# EAGLE schematic untitled (EAGLE 9.6.2)
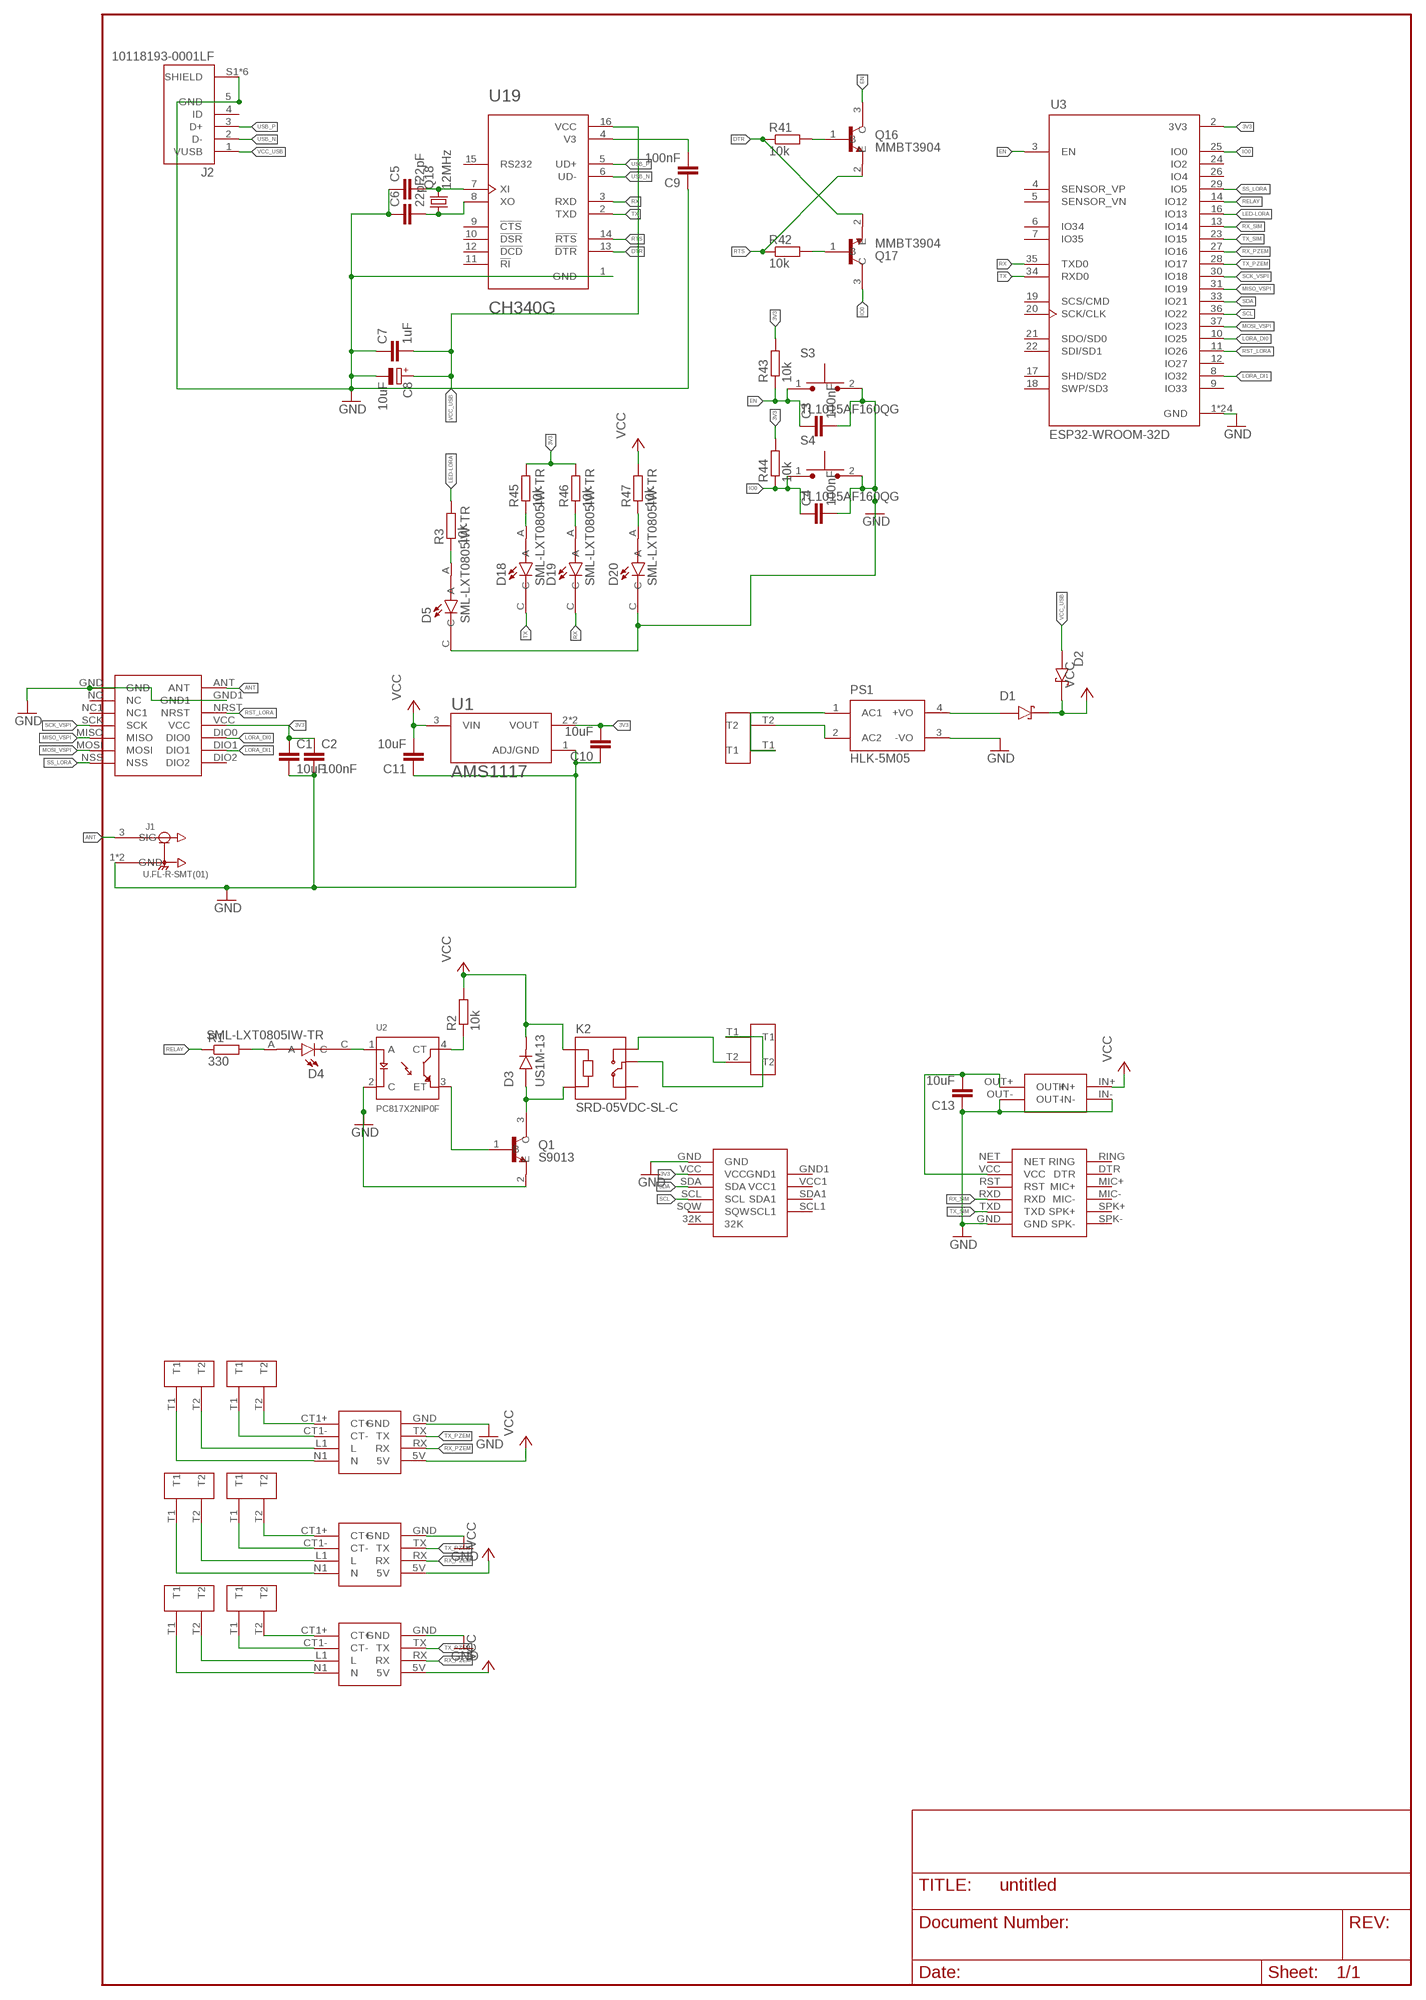
[diagram p0: schematic, sheet 1]

## Parts
C1  10uF  C-EUC0805K  [C0805K]
C2  100nF  C-EUC0805K  [C0805K]
C3  100nF  C-EUC0805K  [C0805K]
C4  100nF  C-EUC0805K  [C0805K]
C5  22pF  C-EUC0805K  [C0805K]
C6  22pF  C-EUC0805K  [C0805K]
C7  1uF  C-EUC0805K  [C0805K]
C8  10uF  CPOL-EU153CLV-0505  [153CLV-0505]
C9  100nF  C-EUC0805K  [C0805K]
C10  10uF  C-EUC0805K  [C0805K]
C11  10uF  C-EUC0805K  [C0805K]
C13  10uF  C-EUC0805K  [C0805K]
D1  1N5819HW-7  [SOD3715X145N]
D2  1N5819HW-7  [SOD3715X145N]
D3  US1M-13  [DIOM5226X240N]
D4  SML-LXT0805IW-TR  [LEDC2012X120N]
D5  SML-LXT0805IW-TR  [LEDC2012X120N]
D18  SML-LXT0805IW-TR  [LEDC2012X120N]
D19  SML-LXT0805IW-TR  [LEDC2012X120N]
D20  SML-LXT0805IW-TR  [LEDC2012X120N]
J1  U.FL-R-SMT(01)  [HRS_U.FL-R-SMT(01)]
J2  10118193-0001LF  [FCI_10118193-0001LF]
K2  SRD-05VDC-SL-C  [RELAY_SRD-05VDC-SL-C]
LORA-NICERF-V1  LORA-NICERF-V2  [LORA-NICERF-V2]
MINI1  MINI360  [MINI360]
PS1  HLK-5M05  [CONV_HLK-5M05]
PZEM004T1  PZEM004T  [PZEM004T]
PZEM004T2  PZEM004T  [PZEM004T]
PZEM004T3  PZEM004T  [PZEM004T]
Q1  S9013  [SOT95P240X120-3N]
Q16  MMBT3904  [SOT95P240X120-3N]
Q17  MMBT3904  [SOT95P240X120-3N]
Q18  12MHz  CRYSTALSM49  [SM49]
R1  330  R-EU_R0805  [R0805]
R2  10k  R-EU_R0805  [R0805]
R3  10k  R-EU_R0805  [R0805]
R41  10k  R-EU_R0805  [R0805]
R42  10k  R-EU_R0805  [R0805]
R43  10k  R-EU_R0805  [R0805]
R44  10k  R-EU_R0805  [R0805]
R45  10k  R-EU_R0805  [R0805]
R46  10k  R-EU_R0805  [R0805]
R47  10k  R-EU_R0805  [R0805]
RTC1  RTC3231  [RTC3231]
S3  TL1015AF160QG  [SW_TL1015AF160QG]
S4  TL1015AF160QG  [SW_TL1015AF160QG]
SIM800L1  SIM800L  [SIM800L]
TB7.1  TB7.62  [TB7.62]
TB7.2  TB7.62  [TB7.62]
TB7.3  TB7.62  [TB7.62]
TB7.4  TB7.62  [TB7.62]
TB7.5  TB7.62  [TB7.62]
TB7.6  TB7.62  [TB7.62]
TB7.7  TB7.62  [TB7.62]
TB7.8  TB7.62  [TB7.62]
U1  AMS1117  [SOT229P700X180-4N]
U2  PC817X2NIP0F  [SOT254P975X400-4N]
U3  ESP32-WROOM-32D  [MODULE_ESP32-WROOM-32D]
U19  CH340G  [SOIC127P600X180-16N]

## Nets
3V3: C1.1 C2.1 C10.2 LORA-NICERF-V1.VCC R43.2 R44.2 R45.2 R46.2 RTC1.VCC U1.2(VOUT) U1.4(VOUT) U3.2(3V3)
ANT: J1.3(SIG) LORA-NICERF-V1.ANT
DTR: Q17.2(E) R41.1 U19.13(!DTR)
EN: C3.1 Q16.3(C) R43.1 S3.1 U3.3(EN)
GND: C1.2 C2.2 C3.2 C4.2 C5.1 C6.1 C7.1 C8.- C9.1 C10.1 C11.1 C13.1 D5.C D20.C J1.1(GND) J1.2(GND) J2.5(GND) J2.S1(SHIELD) J2.S2(SHIELD) J2.S3(SHIELD) J2.S4(SHIELD) J2.S5(SHIELD) J2.S6(SHIELD) LORA-NICERF-V1.GND LORA-NICERF-V1.GND1 MINI1.IN- MINI1.OUT- PS1.3(-VO) PZEM004T1.GND PZEM004T2.GND PZEM004T3.GND Q1.2(E) RTC1.GND S3.2 S4.2 SIM800L1.GND U1.1(ADJ/GND) U2.2(C) U3.1(GND) U3.15(GND) U3.38(GND) U3.39_1(GND) U3.39_2(GND) U3.39_3(GND) U3.39_4(GND) U3.39_5(GND) U3.39_6(GND) U3.39_7(GND) U3.39_8(GND) U3.39_9(GND) U3.39_10(GND) U3.39_11(GND) U3.39_12(GND) U3.39_13(GND) U3.39_14(GND) U3.39_15(GND) U3.39_16(GND) U3.39_17(GND) U3.39_18(GND) U3.39_19(GND) U3.39_20(GND) U3.39_21(GND) U19.1(GND)
IO0: C4.1 Q17.3(C) R44.1 S4.1 U3.25(IO0)
LED-LORA: R3.2 U3.16(IO13)
LORA_DI0: LORA-NICERF-V1.DIO0 U3.10(IO25)
LORA_DI1: LORA-NICERF-V1.DIO1 U3.8(IO32)
MISO_VSPI: LORA-NICERF-V1.MISO U3.31(IO19)
MOSI_VSPI: LORA-NICERF-V1.MOSI U3.37(IO23)
N$1: PS1.2(AC2) TB7.1.T2
N$2: PS1.1(AC1) TB7.1.T1
N$3: D1.A PS1.4(+VO)
N$4: D4.C U2.1(A)
N$5: R2.1 U2.4(CT)
N$6: Q1.1(B) U2.3(ET)
N$7: D3.A K2.A2 Q1.3(C)
N$8: D4.A R1.2
N$9: K2.COM TB7.2.T1
N$10: K2.NO TB7.2.T2
N$11: Q17.1(B) R42.2
N$12: D5.A R3.1
N$13: C13.2 MINI1.OUT+ SIM800L1.VCC
N$14: PZEM004T2.CT1+(CT+) TB7.5.T2
N$15: PZEM004T1.CT1+(CT+) TB7.3.T2
N$16: PZEM004T1.CT1-(CT-) TB7.3.T1
N$17: PZEM004T1.L1(L) TB7.4.T2
N$18: PZEM004T1.N1(N) TB7.4.T1
N$19: PZEM004T2.CT1-(CT-) TB7.5.T1
N$20: PZEM004T2.L1(L) TB7.6.T2
N$21: PZEM004T2.N1(N) TB7.6.T1
N$22: PZEM004T3.CT1+(CT+) TB7.7.T2
N$23: PZEM004T3.CT1-(CT-) TB7.7.T1
N$24: PZEM004T3.L1(L) TB7.8.T2
N$25: PZEM004T3.N1(N) TB7.8.T1
N$99: Q16.1(B) R41.2
N$102: C5.2 Q18.2 U19.7(XI)
N$103: C6.2 Q18.1 U19.8(XO)
N$104: C9.2 U19.4(V3)
N$105: D18.A R45.1
N$106: D19.A R46.1
N$107: D20.A R47.1
RELAY: R1.1 U3.14(IO12)
RST_LORA: LORA-NICERF-V1.NRST U3.11(IO26)
RTS: Q16.2(E) R42.1 U19.14(!RTS)
RX: D19.C U3.35(TXD0) U19.3(RXD)
RX_PZEM: PZEM004T1.RX PZEM004T2.RX PZEM004T3.RX U3.27(IO16)
RX_SIM: SIM800L1.RXD U3.13(IO14)
SCK_VSPI: LORA-NICERF-V1.SCK U3.30(IO18)
SCL: RTC1.SCL U3.36(IO22)
SDA: RTC1.SDA U3.33(IO21)
SS_LORA: LORA-NICERF-V1.NSS U3.29(IO5)
TX: D18.C U3.34(RXD0) U19.2(TXD)
TX_PZEM: PZEM004T1.TX PZEM004T2.TX PZEM004T3.TX U3.28(IO17)
TX_SIM: SIM800L1.TXD U3.23(IO15)
USB_N: J2.2(D-) U19.6(UD-)
USB_P: J2.3(D+) U19.5(UD+)
VCC: C11.2 D1.C(K) D2.C(K) D3.C(K) K2.A1 MINI1.IN+ PZEM004T1.5V PZEM004T2.5V PZEM004T3.5V R2.2 R47.2 U1.3(VIN)
VCC_USB: C7.2 C8.+ D2.A J2.1(VUSB) U19.16(VCC)
Unconnected: J2.4(ID) K2.NC LORA-NICERF-V1.DIO2 LORA-NICERF-V1.NC LORA-NICERF-V1.NC1 RTC1.32K RTC1.GND1 RTC1.SCL1 RTC1.SDA1 RTC1.SQW RTC1.VCC1 SIM800L1.DTR SIM800L1.MIC+ SIM800L1.MIC- SIM800L1.NET SIM800L1.RING SIM800L1.RST SIM800L1.SPK+ SIM800L1.SPK- U3.4(SENSOR_VP) U3.5(SENSOR_VN) U3.6(IO34) U3.7(IO35) U3.9(IO33) U3.12(IO27) U3.17(SHD/SD2) U3.18(SWP/SD3) U3.19(SCS/CMD) U3.20(SCK/CLK) U3.21(SDO/SD0) U3.22(SDI/SD1) U3.24(IO2) U3.26(IO4) U19.9(!CTS) U19.10(!DSR) U19.11(!RI) U19.12(!DCD) U19.15(RS232)

## Library data of the parts
C1-C7 C9-C11 C13 = rcl:C-EU: CAPACITOR, European symbol; SPICEPREFIX: C
C8 = rcl:CPOL-EU: POLARIZED CAPACITOR, European symbol; SPICEPREFIX: C
D1 D2 = 1N5819HW-7:1N5819HW-7: 1N5819HW Series 40 V 1 A Surface Mount Schottky Barrier Rectifier - SOD-123 Check availability <https://pricing.snapeda.com/parts/1N5819HW-7/Diodes%20Inc./view-part?ref=eda>; AVAILABILITY: In Stock; DESCRIPTION: Diode Schottky 40 V 1A Surface Mount SOD-123; MF: Diodes Inc.; MP: 1N5819HW-7; PACKAGE: SOD-123 Fairchild Semiconductor; PRICE: None; PURCHASE-URL: https://pricing.snapeda.com/search/part/1N5819HW-7/?ref=eda
D3 = US1M-13:US1M-13: Diode, Fast Recovery, 1a, 1kv, Do-214ac-2, Full Reel Check availability <https://pricing.snapeda.com/parts/US1M-13/Diodes%20Incorporated/view-part?ref=eda>; AVAILABILITY: In Stock; DESCRIPTION: Diode Standard 1000 V 1A Surface Mount SMA; MF: Diodes Incorporated; MP: US1M-13; PACKAGE: DO-214AC-214 Diodes Incorporated; PRICE: None; PURCHASE-URL: https://pricing.snapeda.com/search/part/US1M-13/?ref=eda
D4 D5 D18-D20 = SML-LXT0805IW-TR:SML-LXT0805IW-TR: LED; Luminous Intensity:11µcd; Viewing Angle:140°; Forward Current:30mA; Forward Voltage:2V; Color:Red; LED Color:Red; Leaded Process Compatible:Yes; Lens Color:White; Mounting Type:Surface Mount ;RoHS Compliant: Yes Check availability <https://pricing.snapeda.com/parts/SML-LXT0805IW-TR/Lumex%20Opto/Components/view-part?ref=eda>; AVAILABILITY: In Stock; DESCRIPTION: Red - LED Indication - Discrete 2V 0805 (2012 Metric); MF: Lumex Opto/Components; MP: SML-LXT0805IW-TR; PACKAGE: 0805 Lumex; PRICE: None; PURCHASE-URL: https://pricing.snapeda.com/search/part/SML-LXT0805IW-TR/?ref=eda
J1 = U.FL-R-SMT_01_:U.FL-R-SMT(01): U.FL Series 6 Ghz 50 Ohm Ultra-small SMT Coaxial Cable Receptacle Check availability <https://pricing.snapeda.com/parts/U.FL-R-SMT%2801%29/Hirose/view-part?ref=eda>; AVAILABILITY: In Stock; DESCRIPTION: U.FL (UMCC) Connector Receptacle, Male Pin 50Ohm Surface Mount Solder. RF Connectors / Coaxial Connectors; MF: Hirose; MP: U.FL-R-SMT(01); PACKAGE: None; PRICE: None; PURCHASE-URL: https://pricing.snapeda.com/search/part/U.FL-R-SMT(01)/?ref=eda
J2 = 10118193-0001LF:10118193-0001LF: Micro USB B Type Receptacle Check availability <https://pricing.snapeda.com/parts/10118193-0001LF/FCI/view-part?ref=eda>; AVAILABILITY: In Stock; DESCRIPTION: USB - micro B USB 2.0 Receptacle Connector 5 Position Surface Mount, Right Angle; Through Hole; MF: FCI; MP: 10118193-0001LF; PACKAGE: None; PRICE: None; PURCHASE-URL: https://pricing.snapeda.com/search/part/10118193-0001LF/?ref=eda
K2 = SRD-05VDC-SL-C:SRD-05VDC-SL-C: 5V Trigger Relay Module For Arduino And Raspberry Pi 5V Trigger Relay Module For Arduino And Raspberry Pi Check availability <https://pricing.snapeda.com/parts/SRD-05VDC-SL-C/Songle%20Relay/view-part?ref=eda>; AVAILABILITY: Not in stock; DESCRIPTION: 5V Trigger Relay Module For Arduino And Raspberry Pi 5V Trigger Relay Module For Arduino And Raspberry Pi; MF: Songle Relay; MP: SRD-05VDC-SL-C; PACKAGE: NON STANDARD-5 Songle Relay; PRICE: None
LORA-NICERF-V1 = LORA-NICERF-V2:LORA-NICERF-V2
MINI1 = mini360:MINI360
PS1 = HLK-5M05:HLK-5M05: AC DC 220V to 5V 5W 5Watt Isolated Switching Step-Down Power Supply Module Converter Check availability <https://pricing.snapeda.com/parts/HLK-5M05/Hi-link/view-part?ref=eda>; AVAILABILITY: Not in stock; MF: Hi-link; MP: HLK-5M05; PACKAGE: Package; PRICE: None
PZEM004T1-PZEM004T3 = PZEM004T:PZEM004T
Q1 = S9013:S9013: SMD Transistors NPN 25V-500mA Check availability <https://pricing.snapeda.com/parts/S9013/JCET/view-part?ref=eda>; AVAILABILITY: In Stock; DESCRIPTION: Bipolar (BJT) Transistor NPN 20V 500mA 625mW Through Hole TO-92-3; MF: JCET; MP: S9013; PACKAGE: SOT-23-3 JCET; PRICE: None; PURCHASE-URL: https://pricing.snapeda.com/search/part/S9013/?ref=eda
Q16 Q17 = MMBT3904:MMBT3904: MMBT3904 Series 40 V CE Breakdown 0.2 A NPN General Purpose Amplifier - SOT-23 Check availability <https://pricing.snapeda.com/parts/MMBT3904/ON%20Semiconductor/view-part?ref=eda>; AVAILABILITY: In Stock; DESCRIPTION: Bipolar (BJT) Transistor NPN 40 V 200 mA 300MHz 300 mW Surface Mount SOT-23-3 (TO-236); MF: ON Semiconductor; MP: MMBT3904; PACKAGE: SOT-23-3 Motorola; PRICE: None
Q18 = crystal:CRYSTAL: CRYSTAL; OC_FARNELL: unknown; OC_NEWARK: unknown
R1-R3 R41-R47 = rcl:R-EU_: RESISTOR, European symbol; SPICEPREFIX: R
RTC1 = rtc3231:RTC3231
S3 S4 = TL1015AF160QG:TL1015AF160QG: Tactile Switch SPST-NO Top Actuated Surface Mount Check availability <https://pricing.snapeda.com/parts/TL1015AF160QG/E-Switch/view-part?ref=eda>; AVAILABILITY: In Stock; DESCRIPTION: Tactile Switch SPST-NO Top Actuated Surface Mount; MF: E-Switch; MP: TL1015AF160QG; PACKAGE: None; PRICE: None; PURCHASE-URL: https://pricing.snapeda.com/search/part/TL1015AF160QG/?ref=eda
SIM800L1 = sim800l:SIM800L
TB7.1-TB7.8 = TB7.62:TB7.62
U1 = AMS1117:AMS1117: Sot223/Pkg 1-Amp 5-Volt Low Drop Out Voltage Regulatator Check availability <https://pricing.snapeda.com/parts/AMS1117/Advanced%20Monolithic%20Systems/view-part?ref=eda>; AVAILABILITY: Not in stock; DESCRIPTION: 1A LOW DROPOUT VOLTAGE REGULATOR SOT-223; MF: Advanced Monolithic Systems; MP: AMS1117; PACKAGE: SOT-223 Seeed Technology; PRICE: None
U2 = PC817X2NIP0F:PC817X2NIP0F: PC817 Series 1 Channel 80 V 5000 Vrms General Purpose Photocoupler - DIP-4 Check availability <https://pricing.snapeda.com/parts/PC817X2NIP0F/Sharp%20Microelectronics/view-part?ref=eda>; AVAILABILITY: Not in stock; DESCRIPTION: Optoisolator Transistor Output 5000Vrms 1 Channel 4-SMD; MF: Sharp Microelectronics; MP: PC817X2NIP0F; PACKAGE: SMD-4 Sharp Microelectronics; PRICE: None
U3 = ESP32-WROOM-32D:ESP32-WROOM-32D: Bluetooth, WiFi 802.11b/g/n, Bluetooth v4.2 + EDR, Class 1, 2 and 3 Transceiver Module 2.4GHz ~ 2.5GHz Integrated, Trace Surface Mount Check availability <https://pricing.snapeda.com/parts/ESP32-WROOM-32D/Espressif%20Systems/view-part?ref=eda>; AVAILABILITY: In Stock; DESCRIPTION: Bluetooth, WiFi 802.11b/g/n, Bluetooth v4.2 +EDR, Class 1, 2 and 3 Transceiver Module 2.4GHz ~ 2.5GHz Integrated; MF: Espressif Systems; MP: ESP32-WROOM-32D; PACKAGE: Module Espressif Systems; PRICE: None; PURCHASE-URL: https://pricing.snapeda.com/search/part/ESP32-WROOM-32D/?ref=eda
U19 = CH340G:CH340G: Check availability <https://pricing.snapeda.com/parts/Ch340G/WCH/view-part?ref=eda>; AVAILABILITY: Not in stock; DESCRIPTION: USB Interface Integrated Circuit; MF: WCH; MP: Ch340G; PACKAGE: None; PRICE: None